# Altium schematic sheet 3.3VBuckConverterSM.SchDoc
size A; SheetNumber: 4; SheetTotal: 7; SPICEModelCacheJBXWNVDI: <root> / <DocumentId>JBXWNVDI</DocumentId> / </root>
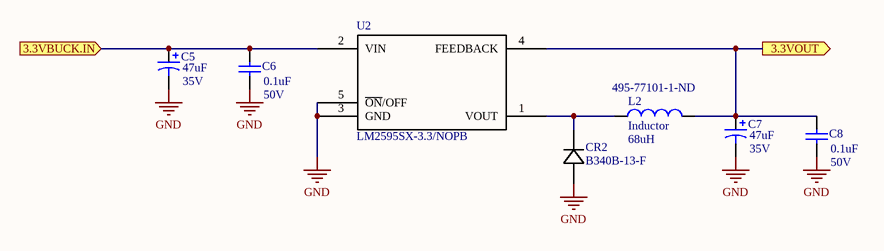
[diagram p0: 3.3VBuckConverterSM.SchDoc]

## Parts
C5  value 47uF  Voltage Rating: 35V  [RB7.6-15]  (hidden comment: Cap Pol1)
C6  value 0.1uF  Voltage Rating: 50V  [RAD-0.3]  (hidden comment: Cap)
C7  value 47uF  Voltage Rating: 35V  [RB7.6-15]  (hidden comment: Cap Pol1)
C8  value 0.1uF  Voltage Rating: 50V  [RAD-0.3]  (hidden comment: Cap)
CR2  B340B-13-F  [B340A-13-F]
L2  Inductor  value 68uH  Supplier Part Number 1: 495-77101-1-ND  [B82472P6683M000]
U2  LM2595SX-3.3/NOPB  [LM2595SX-3P3]

## Ports
3.3VBUCK.IN (in), 3.3VOUT (out)

## Nets
GND: C5.2 C6.1 C7.2 C8.1 CR2.2 U2.3(GND) U2.5(~{ON}/OFF)
3.3VBUCK.IN: C5.1 C6.2 U2.2(VIN) ; port 3.3VBUCK.IN
3.3VOUT: C7.1 C8.2 L2.2 U2.4(FEEDBACK) ; port 3.3VOUT
NetCR2_1: CR2.1 L2.1 U2.1(VOUT)

## Library data of the parts
C5 C7 = Cap Pol1: Polarized Capacitor (Radial); Published: 8-Jun-2000; LatestRevisionDate: 17-Jul-2002; LatestRevisionNote: Re-released for DXP Platform.; PackageReference: RB7.6-15; Publisher: Altium Limited; PackageDescription: Polarized Capacitor (Radial); 2 Leads
C6 C8 = Cap: Capacitor; Published: 8-Jun-2000; LatestRevisionDate: 17-Jul-2002; LatestRevisionNote: Re-released for DXP Platform.; PackageReference: RAD-0.3; Publisher: Altium Limited; PackageDescription: Radial Cap, Thru-Hole; 2 Leads; 0.3 in Pin Spacing
CR2 = B340B-13-F: No Description Available; Mfr_Name: Diodes Inc; Type: DEV; Copyright: Copyright (C) 2022 Ultra Librarian. All rights reserved.; Manufacturer_Part_Number: B340B-13-F; Digi-Key_Part_Number_1: B340B-FDITR-ND; Digi-Key_Part_Number_2: B340B-FDIDKR-ND; Digi-Key_Part_Number_3: B340B-FDICT-ND; RefDes: RefDes
L2 = Inductor: Ind Power Shielded Wirewound 68uH 20% 100KHz Ferrite 820mA Blister T/R; Manufacturer: TDK EPCOS; Code_IEC: 1005; Max DC Current: 680mA; DC Resistance (DCR): 260mR; Published: 8-Jun-2000; LatestRevisionDate: 29-May-2009; LatestRevisionNote: IPC-7351 Footprint Added.; PackageReference: 0402-A; Publisher: Altium Limited; PackageDescription: Chip Inductor; Code_JEITA: 0402; Supplier 1: Digi-Key; Manufacturer Part Number: B82472P6683M000; RoHS: Yes; Category: Fixed Inductors; Stock 1: 3192; Pricing 1: 1=1.69000, 10=1.56600, 25=1.44520, 50=1.20440, 100=1.13220, 250=1.01172, 500=0.86718 (USD); Case/Package: SMD/SMT; Core Material: Ferrite; Weight: 0.052911oz; Package Quantity: 1000; Tolerance: 20%; Packaging: Tape and Reel; Shielding: Shielded; Inductance: 68uH; Termination: SMD/SMT; Test Frequency: 100kHz; DC Current: 820mA; Series: B82472P6; Length: 7.5mm; Depth: 7.5mm; Military Standard: Not; RoHS Compliant: Yes; ComponentLink1URL: https://datasheet.ciiva.com/13285/b82472g6-525414-13285823.pdf?src-supplier=Mouser; ComponentLink1Description: https://datasheet.ciiva.com/13285/b82472g6-525414-13285823.pdf?src-supplier=Mouser